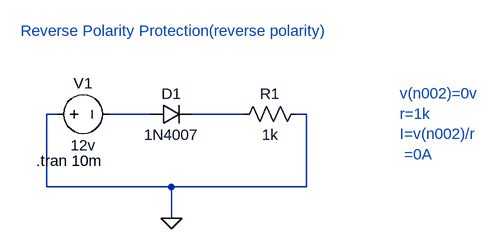
[diagram p0: schematic Reverse Polarity Protection(reverse polarity).asc]
Reverse Polarity Protection(reverse polarity).asc, the LTspice schematic file:
Version 4.1
SHEET 1 880 680
WIRE -32 96 -48 96
WIRE 112 96 48 96
WIRE 256 96 176 96
WIRE 352 96 336 96
WIRE -48 208 -48 96
WIRE 144 208 -48 208
WIRE 352 208 352 96
WIRE 352 208 144 208
WIRE 144 256 144 208
FLAG 144 256 0
SYMBOL voltage -48 96 M90
WINDOW 0 -32 56 VBottom 2
WINDOW 3 32 56 VTop 2
WINDOW 123 0 0 Left 0
WINDOW 39 0 0 Left 0
SYMATTR InstName V1
SYMATTR Value 12v
SYMBOL res 352 80 R90
WINDOW 0 0 56 VBottom 2
WINDOW 3 32 56 VTop 2
SYMATTR InstName R1
SYMATTR Value 1k
SYMBOL diode 112 80 M90
WINDOW 0 0 32 VBottom 2
WINDOW 3 32 32 VTop 2
SYMATTR InstName D1
SYMATTR Value 1N4007
TEXT -64 168 Left 2 !.tran 10m
TEXT -88 -32 Left 2 ;Reverse Polarity Protection(reverse polarity)
TEXT 496 64 Left 2 ;v(n002)=0v\nr=1k\nI=v(n002)/r\n =0A

The netlist it stands for:
* Reverse Polarity Protection(reverse polarity).asc
V1 0 N001 12v
R1 0 N002 1k
D1 N001 N002 1N4007
.model D D
.lib standard.dio
.tran 10m
* Reverse Polarity Protection(reverse polarity)
* v(n002)=0v
* r=1k
* I=v(n002)/r
*  =0A
.backanno
.end